# EAGLE design solo (EAGLE 7.5.0)
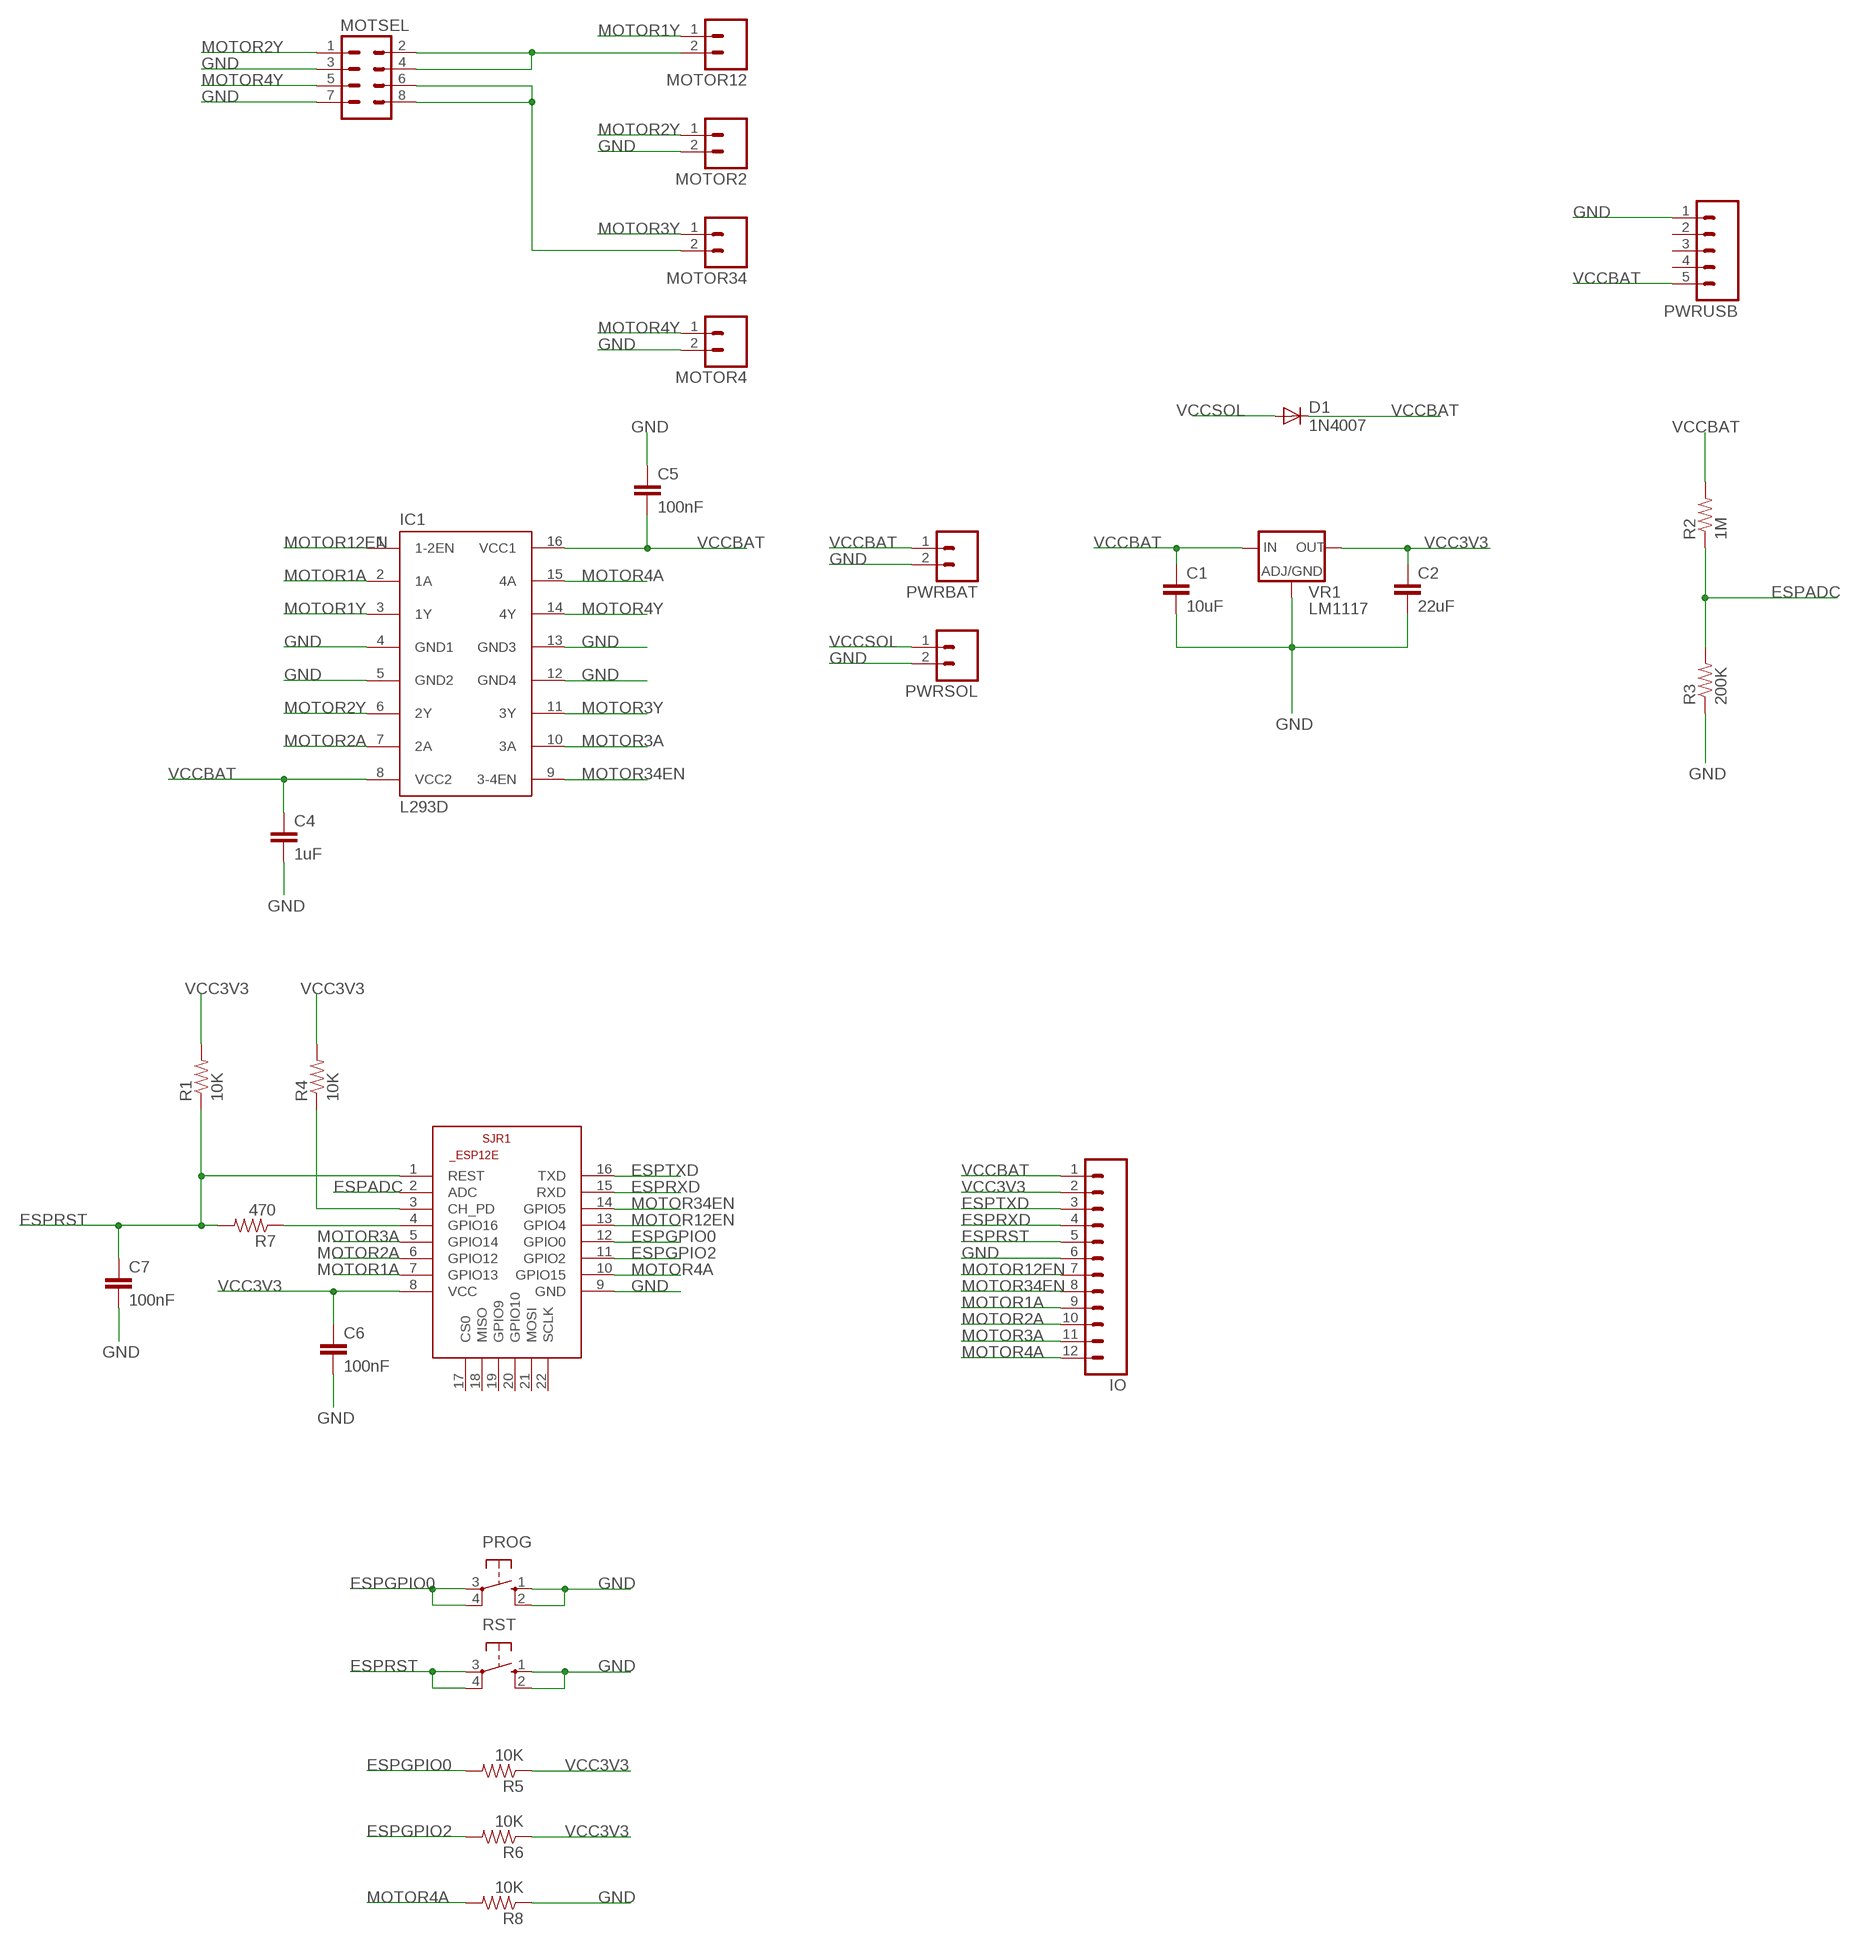
[diagram p0: schematic, sheet 1]

## Parts
C1  10uF  CAP1206  [1206]
C2  22uF  CAP1206  [1206]
C4  1uF  CAP1206  [1206]
C5  100nF  CAP1206  [1206]
C6  100nF  CAP1206  [1206]
C7  100nF  CAP1206  [1206]
D1  1N4007  1N4004  [DO41-10]
IC1  L293D  [DIL16]
IO  M12PTH  [1X12]
MOTOR2  M023.5MM  [SCREWTERMINAL-3.5MM-2]
MOTOR4  M023.5MM  [SCREWTERMINAL-3.5MM-2]
MOTOR12  M023.5MM  [SCREWTERMINAL-3.5MM-2]
MOTOR34  M023.5MM  [SCREWTERMINAL-3.5MM-2]
MOTSEL  M04X2  [2X4]
PROG  10-XX  [B3F-10XX]
PWRBAT  M023.5MM  [SCREWTERMINAL-3.5MM-2]
PWRSOL  M023.5MM  [SCREWTERMINAL-3.5MM-2]
PWRUSB  M05PTH  [1X05]
R1  10K  RESISTOR1206  [1206]
R2  1M  RESISTOR1206  [1206]
R3  200K  RESISTOR1206  [1206]
R4  10K  RESISTOR1206  [1206]
R5  10K  RESISTOR1206  [1206]
R6  10K  RESISTOR1206  [1206]
R7  470  RESISTOR1206  [1206]
R8  10K  RESISTOR1206  [1206]
RST  10-XX  [B3F-10XX]
SJR1  ESP8266-12EESP12E  [ESP8266-ESP12E]
VR1  LM1117  [SOT223]

## Nets
ESPADC: R2.1 R3.2 SJR1.2(ADC)
ESPCHPD: R4.1 SJR1.3(CH_PD)
ESPGPIO0: PROG.3(P) PROG.4(P1) R5.2 SJR1.12(GPIO0)
ESPGPIO2: R6.2 SJR1.11(GPIO2)
ESPRST: C7.1 IO.5 R1.1 R7.2 RST.3(P) RST.4(P1) SJR1.1(REST)
ESPRXD: IO.4 SJR1.15(RXD)
ESPTXD: IO.3 SJR1.16(TXD)
GND: C1.2 C2.2 C4.2 C5.1 C6.2 C7.2 IC1.4(GND1) IC1.5(GND2) IC1.12(GND4) IC1.13(GND3) IO.6 MOTOR2.2 MOTOR4.2 MOTSEL.3 MOTSEL.7 PROG.1(S) PROG.2(S1) PWRBAT.2 PWRSOL.2 PWRUSB.1 R3.1 R8.1 RST.1(S) RST.2(S1) SJR1.9(GND) VR1.1(ADJ/GND)
MOTOR1A: IC1.2(1A) IO.9 SJR1.7(GPIO13)
MOTOR1Y: IC1.3(1Y) MOTOR12.1
MOTOR2A: IC1.7(2A) IO.10 SJR1.6(GPIO12)
MOTOR2Y: IC1.6(2Y) MOTOR2.1 MOTSEL.1
MOTOR3A: IC1.10(3A) IO.11 SJR1.5(GPIO14)
MOTOR3Y: IC1.11(3Y) MOTOR34.1
MOTOR4A: IC1.15(4A) IO.12 R8.2 SJR1.10(GPIO15)
MOTOR4Y: IC1.14(4Y) MOTOR4.1 MOTSEL.5
MOTOR12EN: IC1.1(1-2EN) IO.7 SJR1.13(GPIO4)
MOTOR34EN: IC1.9(3-4EN) IO.8 SJR1.14(GPIO5)
N$1: MOTOR12.2 MOTSEL.2 MOTSEL.4
N$2: MOTOR34.2 MOTSEL.6 MOTSEL.8
N$3: R7.1 SJR1.4(GPIO16)
VCC3V3: C2.1 C6.1 IO.2 R1.2 R4.2 R5.1 R6.1 SJR1.8(VCC) VR1.2(OUT)
VCCBAT: C1.1 C4.1 C5.2 D1.C IC1.8(VCC2) IC1.16(VCC1) IO.1 PWRBAT.1 PWRUSB.5 R2.2 VR1.3(IN)
VCCSOL: D1.A PWRSOL.1
Unconnected: PWRUSB.2 PWRUSB.3 PWRUSB.4 SJR1.17(CS0) SJR1.18(MISO) SJR1.19(GPIO9) SJR1.20(GPIO10) SJR1.21(MOSI) SJR1.22(SCLK)

## Library data of the parts
C1 C2 C4-C7 = SparkFun-Capacitors:CAP: Capacitor Standard 0603 ceramic capacitor, and 0.1" leaded capacitor.
D1 = adafruit:1N4004: DIODE General purpose 1N400x type rectifier (With bigger pads) http://www.ladyada.net/library/pcb/eaglelibrary.html
IC1 = st-microelectronics:L293D: PUSH-PULL 4 CHANNEL DRIVER; MPN: L293D; OC_FARNELL: 9589619; OC_NEWARK: 56P8249
IO = SparkFun-Connectors:M12: Header 12 Standard 12-pin 0.1" header. Use with straight break away headers (SKU : PRT-00116), right angle break away headers (PRT-00553), swiss pins (PRT-00743), machine pins (PRT-00117), and female headers (PRT-00115).
MOTOR2 MOTOR4 MOTOR12 MOTOR34 PWRBAT PWRSOL = SparkFun-Connectors:M02: Standard 2-pin 0.1" header. Use with - straight break away headers ( PRT-00116) - right angle break away headers (PRT-00553) - swiss pins (PRT-00743) - machine pins (PRT-00117) - female headers (PRT-00115) Molex polarized connector foot print use with: PRT-08233 with associated crimp pins and housings. 2.54_SCREWTERM for use with PRT-10571. 3.5mm Screw Terminal footprints for PRT-08084 5mm Screw Terminal footprints for use with PRT-08432; PROD_ID: CONN-08399
MOTSEL = SparkFun-Connectors:M04X2: .1" header, two rows of four.
PROG RST = switch-omron:10-XX: OMRON SWITCH; MPN: B3F-1000; OC_FARNELL: 176432; OC_NEWARK: 36M3542
PWRUSB = SparkFun-Connectors:M05: Header 5 Standard 5-pin 0.1" header. Use with straight break away headers (SKU : PRT-00116), right angle break away headers (PRT-00553), swiss pins (PRT-00743), machine pins (PRT-00117), and female headers (PRT-00115). Molex polarized connector foot print use with SKU : PRT-08230 with associated crimp pins and housings.
R1-R8 = SparkFun-Passives:RESISTOR: Resistor Basic schematic elements and footprints for 0603, 1206, and PTH resistors.
SJR1 = esp12e:ESP8266-12E: ESP8266-12E Library for Eagle CAD The author not responsible for any damages or errors!. Created by Suhail jr.lt;/author>
VR1 = PIC32-RETROBSD_Rev.A:LM1117

## Board
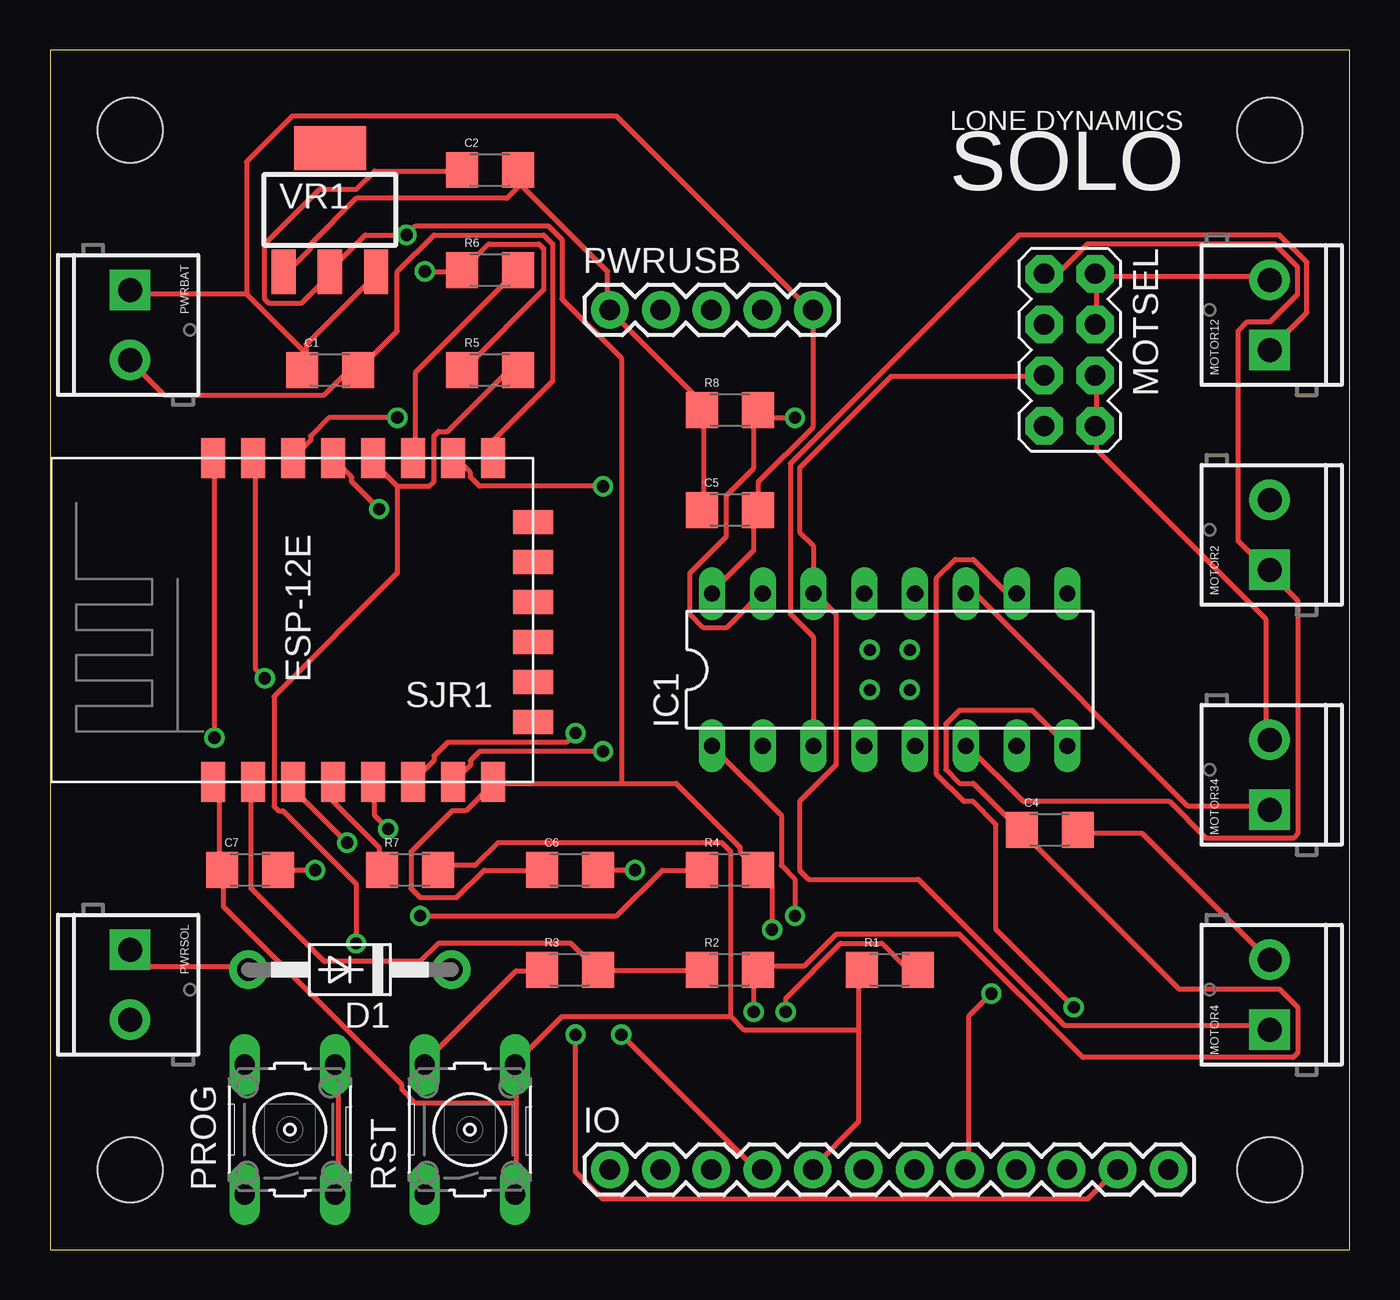
[diagram p1: board, top side]
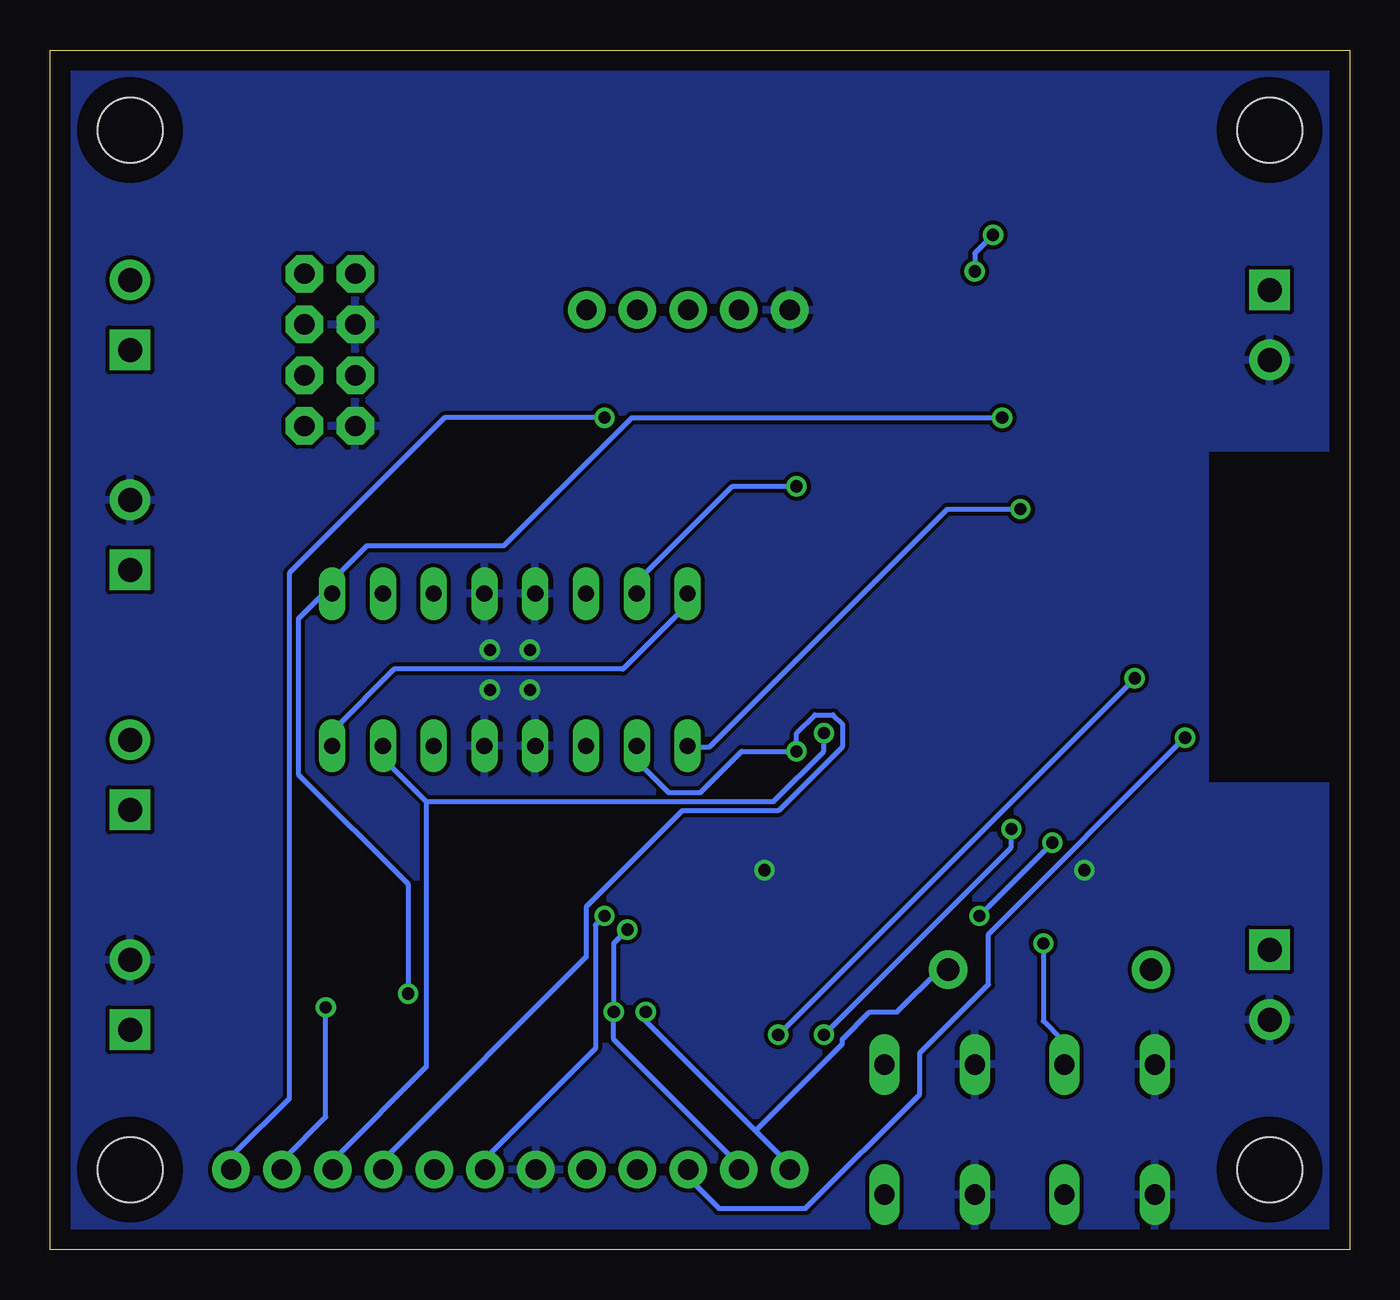
[diagram p2: board, bottom side, seen from below]

Size 65 x 60 mm. Coordinates in mm from the lower left corner, seen from the top.
Outline: 0,0 65,0 65,60 0,60 0,0
Copper layers (1*16): Top 0.035mm / dielectric 1.5mm / Bottom 0.035mm
Design rules "default *": minimum track width 10mil, minimum drill 24mil, track to track 8mil, track to pad 8mil, pad to pad 10mil, via to via 8mil, smd to smd 8mil, copper to edge 40mil, drill to drill 8mil, minimum pad ring 10mil, minimum via ring 8mil, stop-mask expansion 4mil, vias tented up to drill 0mil, thermal gap 10mil
Holes 3.25 mm at 4,56 4,4 61,4 61,56
tRestrict: area 38,19 to 46,39

### Footprints (pad centres in the part's own frame; a part is rotated, then mirrored left to right if it is on the bottom)
1206 = smd 1.6 x 1.8: 1 -1.4,0; 2 1.4,0
DO41-10 = drill 1.118 pad 1.93: A 5.08,0; C -5.08,0
DIL16 = drill 0.813 long: 1 -8.89,-3.81; 2 -6.35,-3.81; 3 -3.81,-3.81; 4 -1.27,-3.81; 5 1.27,-3.81; 6 3.81,-3.81; 7 6.35,-3.81; 8 8.89,-3.81; 9 8.89,3.81; 10 6.35,3.81; 11 3.81,3.81; 12 1.27,3.81; 13 -1.27,3.81; 14 -3.81,3.81; 15 -6.35,3.81; 16 -8.89,3.81
1X12 = drill 1.016 pad 1.88: 1 0,0; 2 2.54,0; 3 5.08,0; 4 7.62,0; 5 10.16,0; 6 12.7,0; 7 15.24,0; 8 17.78,0; 9 20.32,0; 10 22.86,0; 11 25.4,0; 12 27.94,0
SCREWTERMINAL-3.5MM-2 = drill 1.2 pad 2.032 square: 1 0,0 | drill 1.2 pad 2.032: 2 3.5,0
2X4 = drill 1.016 pad 1.88 octagon: 1 -3.81,-1.27; 2 -3.81,1.27; 3 -1.27,-1.27; 4 -1.27,1.27; 5 1.27,-1.27; 6 1.27,1.27; 7 3.81,-1.27; 8 3.81,1.27
B3F-10XX = drill 1.016 long: 1 -3.251,2.261; 2 3.251,2.261; 3 -3.251,-2.261; 4 3.251,-2.261
1X05 = drill 1.016 pad 1.88: 1 0,0; 2 2.54,0; 3 5.08,0; 4 7.62,0; 5 10.16,0
ESP8266-ESP12E = smd 2 x 1.2: 1 -7.62,5.84; 2 -7.62,3.84; 3 -7.62,1.84; 4 -7.62,-0.16; 5 -7.62,-2.16; 6 -7.62,-4.16; 7 -7.62,-6.16; 8 -7.62,-8.16; 9 8.58,-8.16; 10 8.58,-6.16; 11 8.58,-4.16; 12 8.58,-2.16; 13 8.58,-0.16; 14 8.58,1.84; 15 8.58,3.84; 16 8.58,5.84 | smd 1.2 x 2: 17 -4.62,-10.16; 18 -2.62,-10.16; 19 -0.62,-10.16; 20 1.38,-10.16; 21 3.38,-10.16; 22 5.38,-10.16
SOT223 = smd 1.219 x 2.235: 1 -2.311,-3.099; 2 0,-3.099; 3 2.311,-3.099 | smd 3.6 x 2.2: 4 0,3.099

### Placement (x,y rotation side)
C1  14,44 0 top
C2  22,54 0 top
C4  50,21 0 top
C5  34,37 0 top
C6  26,19 0 top
C7  10,19 0 top
D1  15,14 180 top
IC1  42,29 0 top
IO  28,4 0 top
MOTOR2  61,34 90 top
MOTOR4  61,11 90 top
MOTOR12  61,45 90 top
MOTOR34  61,22 90 top
MOTSEL  51,45 270 top
PROG  12,6 90 top
PWRBAT  4,48 270 top
PWRSOL  4,15 270 top
PWRUSB  28,47 0 top
R1  42,14 0 top
R2  34,14 0 top
R3  26,14 0 top
R4  34,19 0 top
R5  22,44 0 top
R6  22,49 0 top
R7  18,19 0 top
R8  34,42 0 top
RST  21,6 90 top
SJR1  14,31 90 top
VR1  14,52 0 top

### Tracks (layer width: path | path; a pad name or v marks a point on that pad's centre or on a via)
ESPADC
  Top 0.254: R2.1 32.46,13.95 27.43,13.95 R3.2 27.2,14.17 26.06,15.32 19.43,15.32 18.52,14.4 13.72,14.4 10.06,18.06 10.06,23.32 SJR1.2
ESPCHPD  (via drill 0.61)
  Top 0.254: v18.52,16.69 28.35,16.69 30.63,18.97 32.46,18.97 R4.1 | v14.86,20.34 12.34,22.86 12.34,23.32 SJR1.3
  Bottom 0.254: v14.86,20.34 v18.52,16.69
ESPGPIO0  (via drill 0.61)
  Top 0.254: PROG.3 14.4,2.97 14.4,9.14 PROG.4 | 17.37,38.18 18.97,38.18 19.2,38.41 19.2,40.69 19.43,40.92 19.89,40.92 22.86,43.89 23.32,43.89 R5.2 | 17.37,38.18 16,39.55 SJR1.12 | v15.32,15.32 15.32,18.29 11.66,21.95 11.43,21.95 11.2,22.17 11.2,27.66 17.37,33.83 17.37,38.18
  Bottom 0.254: v15.32,15.32 15.32,11.43 14.4,10.52 14.4,9.37 PROG.4
ESPGPIO2
  Top 0.254: R6.2 23.32,48.92 18.29,43.89 18.29,39.78 SJR1.11
ESPRST
  Top 0.254: 40.46,10.97 40.46,6.4 38.18,4.12 IO.5 | 40.46,10.97 40.46,13.95 R1.1 | 34.06,11.66 34.06,19.89 33.6,20.34 22.4,20.34 21.26,19.2 19.43,19.2 R7.2 | 34.06,11.66 34.75,10.97 40.46,10.97 | SJR1.1 8.23,23.32 8.46,23.09 8.46,19.2 C7.1 8.69,18.97 8.69,17.14 17.6,8.23 17.6,8 18.29,7.32 23.32,7.32 | 23.32,7.32 23.32,9.14 RST.4 23.32,9.37 25.6,11.66 34.06,11.66 | 23.32,7.32 23.32,2.97 RST.3
ESPRXD  (via drill 0.61)
  Top 0.254: v10.74,28.57 10.29,29.03 10.29,39.55 SJR1.15 | v28.57,10.74 35.43,3.89 IO.4
  Bottom 0.254: v28.57,10.74 v10.74,28.57
ESPTXD  (via drill 0.61)
  Top 0.254: v8.23,25.6 8.23,39.55 SJR1.16
  Bottom 0.254: v8.23,25.6 18.06,15.77 18.06,13.26 21.49,9.83 21.49,7.77 27.2,2.06 31.55,2.06 32.92,3.43 32.92,3.89 IO.3
GND  (via drill 0.6, 0.61)
  Top 0.254: C5.1 32.69,37.03 32.69,41.83 R8.1 32.46,42.06 32.46,42.52 28.12,46.86 PWRUSB.1 27.89,47.09 27.89,48.92 23.55,53.26 | v13.26,18.97 11.43,18.97 C7.2 | R3.1 24.46,13.95 23.32,13.95 18.75,9.37 RST.2 | v29.26,18.97 27.43,18.97 C6.2 | C4.2 51.44,20.8 54.63,20.8 60.81,14.63 MOTOR4.2 | PWRBAT.2 4.12,44.35 5.71,42.75 13.72,42.75 14.86,43.89 15.32,43.89 C1.2 15.54,44.12 17.37,45.95 17.37,48.92 19.2,50.75 24.69,50.75 25.15,50.29 25.15,43.43 22.17,40.46 22.17,39.78 SJR1.9 | 23.55,53.26 23.55,53.95 C2.2 23.55,53.26 | 23.55,53.26 22.86,52.58 15.32,52.58 13.03,50.29 13.03,50.06 11.89,48.92 VR1.1
  other vias: 41,30 43,30 41,28 43,28
  pour Top: 38,39 38,36 40,36 40,22 38,22 38,19 46,19 46,22 44,22 44,36 46,36 46,39
  pour Bottom: 0,60 0,0 65,0 65,60
MOTOR1A  (via drill 0.61)
  Top 0.254: v27.66,24.92 21.49,24.92 21.03,24.46 21.03,24.23 20.34,23.55 SJR1.7
  Bottom 0.254: IC1.2 35.43,25.15 35.43,24.23 34.06,22.86 32.46,22.86 30.4,24.92 v27.66,24.92 27.66,25.83 26.75,26.75 25.83,26.75 25.38,26.29 25.38,25.15 28.57,21.95 33.38,21.95 38.18,17.14 38.18,14.63 48.23,4.57 48.23,4.12 IO.9
MOTOR1Y
  Top 0.254: IC1.3 38.18,25.38 38.18,30.63 37.03,31.77 37.03,39.32 48.46,50.75 61.49,50.75 62.87,49.38 62.87,46.86 61.04,45.03 MOTOR12.1
MOTOR2A  (via drill 0.61)
  Top 0.254: v26.29,25.83 25.83,25.38 19.89,25.38 19.2,24.69 19.2,24.46 18.29,23.55 SJR1.6
  Bottom 0.254: v26.29,25.83 26.29,24.92 28.8,22.4 46.18,22.4 | 46.18,22.4 48.23,24.46 48.23,25.15 IC1.7 | 46.18,22.4 46.18,9.14 50.75,4.57 50.75,4.12 IO.10
MOTOR2Y
  Top 0.254: IC1.6 45.95,25.15 48.69,22.4 56.01,22.4 57.84,20.57 62.18,20.57 62.41,20.8 62.41,32.46 61.04,33.83 MOTOR2.1 60.81,34.06 59.44,35.43 59.44,45.95 59.89,46.41 61.04,46.41 62.41,47.78 62.41,49.15 61.27,50.29 51.89,50.29 50.52,48.92 49.84,48.92 MOTSEL.1
MOTOR3A  (via drill 0.61)
  Top 0.254: v16.92,21.03 16.23,21.72 16.23,23.32 SJR1.5 | v26.29,10.74 26.29,3.89 27.66,2.52 51.89,2.52 53.26,3.89 IO.11 | v51.21,12.12 47.32,16 47.32,21.26 46.18,22.4 45.72,22.4 44.35,23.77 44.35,33.6 45.26,34.52 46.18,34.52 47.78,32.92 48.23,32.92 IC1.10
  Bottom 0.254: v16.92,21.03 16.92,20.12 v26.29,10.74 | v51.21,12.12 51.21,6.63 53.26,4.57 53.26,4.12 IO.11
MOTOR3Y
  Top 0.254: IC1.11 45.95,32.69 46.41,32.69 56.92,22.17 60.81,22.17 MOTOR34.1
MOTOR4A  (via drill 0.61)
  Top 0.254: 35.2,41.6 35.2,39.09 33.83,37.72 33.83,35.66 32,33.83 32,31.77 32.69,31.09 33.83,31.09 35.43,32.69 IC1.15 | 35.2,41.6 35.2,41.83 R8.2 35.2,41.6 | v27.66,38.18 21.49,38.18 21.03,38.63 21.03,38.86 20.34,39.55 SJR1.10 | 35.2,41.6 v37.26,41.6
  Bottom 0.254: v27.66,38.18 30.86,38.18 35.43,33.6 35.43,32.92 IC1.15 | v37.26,41.6 45.26,41.6 53.03,33.83 53.03,7.54 55.78,4.8 55.78,4.12 IO.12
MOTOR4Y
  Top 0.254: MOTSEL.5 49.61,43.66 42.06,43.66 37.49,39.09 37.49,35.89 38.18,35.2 38.18,32.92 IC1.14 38.41,32.69 39.32,31.77 39.32,24.23 37.49,22.4 37.49,18.97 37.95,18.52 43.43,18.52 50.75,11.2 60.81,11.2 MOTOR4.1
MOTOR12EN  (via drill 0.61)
  Top 0.254: v16.46,37.03 15.09,38.41 15.09,38.63 14.17,39.55 SJR1.13 | v37.26,16.69 37.26,18.52 36.58,19.2 36.58,21.72 33.15,25.15 IC1.1
  Bottom 0.254: v16.46,37.03 20.12,37.03 32,25.15 32.92,25.15 IC1.1 | v37.26,16.69 37.72,16.23 37.72,10.06 43.2,4.57 43.2,4.12 IO.7
MOTOR34EN  (via drill 0.61)
  Top 0.254: v17.37,41.6 13.95,41.6 13.03,40.69 13.03,40.46 12.34,39.78 SJR1.14 | v47.09,12.8 45.95,11.66 45.95,4.12 IO.8
  Bottom 0.254: v17.37,41.6 35.89,41.6 42.29,35.2 49.15,35.2 50.75,33.6 50.75,32.92 IC1.9 50.98,32.69 51.44,32.69 52.58,31.55 52.58,23.77 47.09,18.29 v47.09,12.8
N$1
  Top 0.254: 52.35,48.69 52.35,46.41 MOTSEL.4 | 52.35,48.69 60.81,48.69 MOTOR12.2 | 52.35,48.69 MOTSEL.2
N$2
  Top 0.254: MOTSEL.6 52.35,43.66 52.35,41.38 MOTSEL.8 52.35,41.15 52.35,40.01 60.81,31.55 60.81,25.6 MOTOR34.2
N$3
  Top 0.254: R7.1 16.46,19.2 16.46,20.12 14.17,22.4 14.17,23.32 SJR1.4
VCC3V3  (via drill 0.61)
  Top 0.254: v36.8,11.89 36.8,12.57 39.55,15.32 41.6,15.32 42.75,14.17 43.2,14.17 R1.2 | 22.17,23.32 20.8,21.95 20.12,21.95 18.06,19.89 18.06,18.06 18.52,17.6 20.34,17.6 21.72,18.97 24.46,18.97 C6.1 | 22.17,23.32 28.57,23.32 | 28.57,23.32 31.32,23.32 34.52,20.12 34.52,19.89 35.2,19.2 R4.2 35.43,18.97 36.12,18.29 v36.12,16 | 22.17,23.32 SJR1.8 | R5.1 20.8,44.12 24.69,48.01 24.69,50.06 24.46,50.29 21.95,50.29 20.8,49.15 R6.1 20.57,48.92 v18.75,48.92 | C2.1 20.57,53.95 16.23,53.95 15.32,53.03 13.49,53.03 10.74,50.29 10.74,47.55 10.97,47.32 12.57,47.32 13.95,48.69 VR1.2 13.95,48.92 15.77,50.75 v17.83,50.75 18.29,51.21 24.92,51.21 25.6,50.52 25.6,47.55 28.57,44.58 28.57,23.32
  Bottom 0.254: IO.2 30.4,4.12 36.8,10.52 v36.8,11.89 36.8,15.32 v36.12,16 | v18.75,48.92 18.75,49.84 v17.83,50.75
VCCBAT  (via drill 0.61)
  Top 0.254: v35.2,11.89 35.2,13.95 R2.2 35.43,14.17 37.72,14.17 39.32,15.77 45.49,15.77 51.66,9.6 62.18,9.6 62.41,9.83 62.41,12.12 61.49,13.03 56.46,13.03 48.69,20.8 C4.1 48.46,21.03 46.18,23.32 45.49,23.32 44.81,24 44.81,26.29 45.49,26.98 49.15,26.98 50.75,25.38 IC1.8 | 12.8,44.81 12.8,45.26 16.23,48.69 VR1.3 | 12.8,44.81 12.8,44.12 C1.1 12.8,44.81 | 9.83,47.78 4.12,47.78 PWRBAT.1 | 12.8,44.81 9.83,47.78 | IC1.16 33.15,32.92 35.2,34.98 35.2,36.8 C5.2 35.43,37.03 35.43,38.41 38.18,41.15 38.18,46.86 PWRUSB.5 37.95,47.09 28.35,56.69 12.12,56.69 9.83,54.41 9.83,47.78
  Bottom 0.254: v35.2,11.89 35.2,11.43 29.72,5.94 | 29.72,5.94 27.89,4.12 IO.1 | 29.72,5.94 25.38,10.29 25.38,10.52 24,11.89 22.63,11.89 20.57,13.95 20.12,13.95 D1.C | IC1.8 50.75,25.38 50.75,26.06 47.78,29.03 36.35,29.03 33.15,32.23 33.15,32.69 IC1.16
VCCSOL
  Top 0.254: D1.A 9.83,14.17 4.8,14.17 4.12,14.86 PWRSOL.1

### Text on the board
tPlace: LONE DYNAMICS | SOLO